# Altium project ultra96_uart_conv.PrjPCB
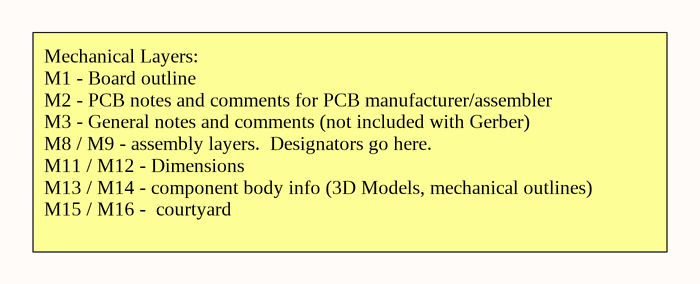
[diagram p0: 00_sch_notes.SchDoc]
2 sheets, 2 parts. Net scope: global (net labels, ports and power ports of the same name join across sheets).
Board file: PCB1.PcbDoc
Sheets:
  00_sch_notes.SchDoc
  01_sch_headers.SchDoc

## Sheet 00_sch_notes.SchDoc
size A

### Notes on the sheet
- Mechanical Layers:
  M1 - Board outline
  M2 - PCB notes and comments for PCB manufacturer/assembler
  M3 - General notes and comments (not included with Gerber)
  M8 / M9 - assembly layers.  Designators go here.
  M11 / M12 - Dimensions
  M13 / M14 - component body info (3D Models, mechanical outlines)
  M15 / M16 -  courtyard

## Sheet 01_sch_headers.SchDoc
size A
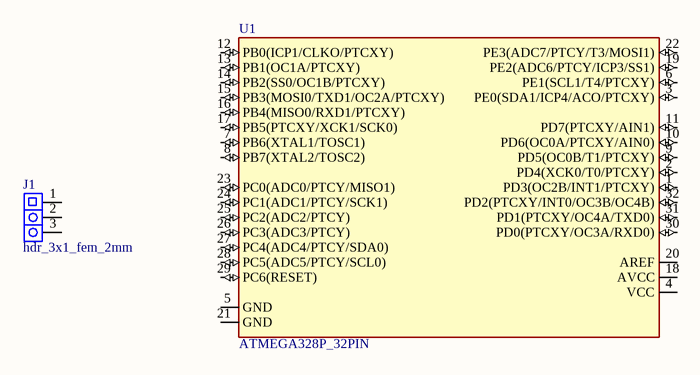
[diagram p1: 01_sch_headers.SchDoc]

### Parts
J1  hdr_3x1_fem_2mm  [HDR_3x1_FEM_2MM]
U1  ATMEGA328P_32PIN  [TQFP80P900X900X120-32N]

### Nets

Not connected (* = marked no-connect by the designer): J1 1(RX) 2(TX) 3(GND); U1 1(PD3(OC2B/INT1/PTCXY)) 2(PD4(XCK0/T0/PTCXY)) 3(PE0(SDA1/ICP4/ACO/PTCXY)) 4(VCC) 5(GND) 6(PE1(SCL1/T4/PTCXY)) 7(PB6(XTAL1/TOSC1)) 8(PB7(XTAL2/TOSC2)) 9(PD5(OC0B/T1/PTCXY)) 10(PD6(OC0A/PTCXY/AIN0)) 11(PD7(PTCXY/AIN1)) 12(PB0(ICP1/CLKO/PTCXY)) 13(PB1(OC1A/PTCXY)) 14(PB2(SS0/OC1B/PTCXY)) 15(PB3(MOSI0/TXD1/OC2A/PTCXY)) 16(PB4(MISO0/RXD1/PTCXY)) 17(PB5(PTCXY/XCK1/SCK0)) 18(AVCC) 19(PE2(ADC6/PTCY/ICP3/SS1)) 20(AREF) 21(GND) 22(PE3(ADC7/PTCY/T3/MOSI1)) 23(PC0(ADC0/PTCY/MISO1)) 24(PC1(ADC1/PTCY/SCK1)) 25(PC2(ADC2/PTCY)) 26(PC3(ADC3/PTCY)) 27(PC4(ADC4/PTCY/SDA0)) 28(PC5(ADC5/PTCY/SCL0)) 29(PC6(RESET)) 30(PD0(PTCXY/OC3A/RXD0)) 31(PD1(PTCXY/OC4A/TXD0)) 32(PD2(PTCXY/INT0/OC3B/OC4B))

### Library data of the parts
J1 = hdr_3x1_fem_2mm: Manufacturer: Sullins; Manufacturer Part Number: NPPN031FGGN-RC; Number of Positions: 3; Connector Type: Header,Socket; Pitch: 0.079inch; Supplier 1: Digi-Key; Stock 1: 6751; Pricing 1: 1=0.82, 10=0.721, 100=0.6217, 500=0.50868, 1000=0.45216, 5000=0.4082 (USD); Mount: Through Hole; Colour: Black; Contact Plating: Gold; Package Quantity: 1000; Number of Rows: 1; Packaging: Bulk; Termination: Solder; Supplier Part Number 1: S5752-03-ND
U1 = ATMEGA328P_32PIN: Manufacturer: Microchip / Atmel; Manufacturer Part Number: ATMEGA328PB-AUR; Frequency: 20MHz; Interface: I2C,SPI,UART,USART; Number of I/Os: 27; Oscillator Type: Internal; RAM Size: 2KB; Number of Timers/Counters: 5; Watchdog Timer: Yes; Memory Type: FLASH; Memory Size: 32KB; Peripherals: Brown-out Detect/Reset,POR,PWM,WDT; Min Supply Voltage: 1.8V; Max Supply Voltage: 5.5V; Core Architecture: AVR; Operating Supply Voltage: 5V; Supplier 1: Digi-Key; Stock 1: 4564; Pricing 1: 1=1.46, 25=1.3392, 100=1.2154 (USD); Mount: Surface Mount; Case/Package: TQFP; Number of Pins: 32; Contact Plating: Matte,Tin; Min Operating Temperature: -40°C; Max Operating Temperature: 85°C; Packaging: Tape and Reel; Number of Programmable I/O: 27; Max Frequency: 20MHz; Supplier Part Number 1: ATMEGA328PB-AURDKR-ND